# Altium project GeneralPurposePowerSupply.PrjPcb
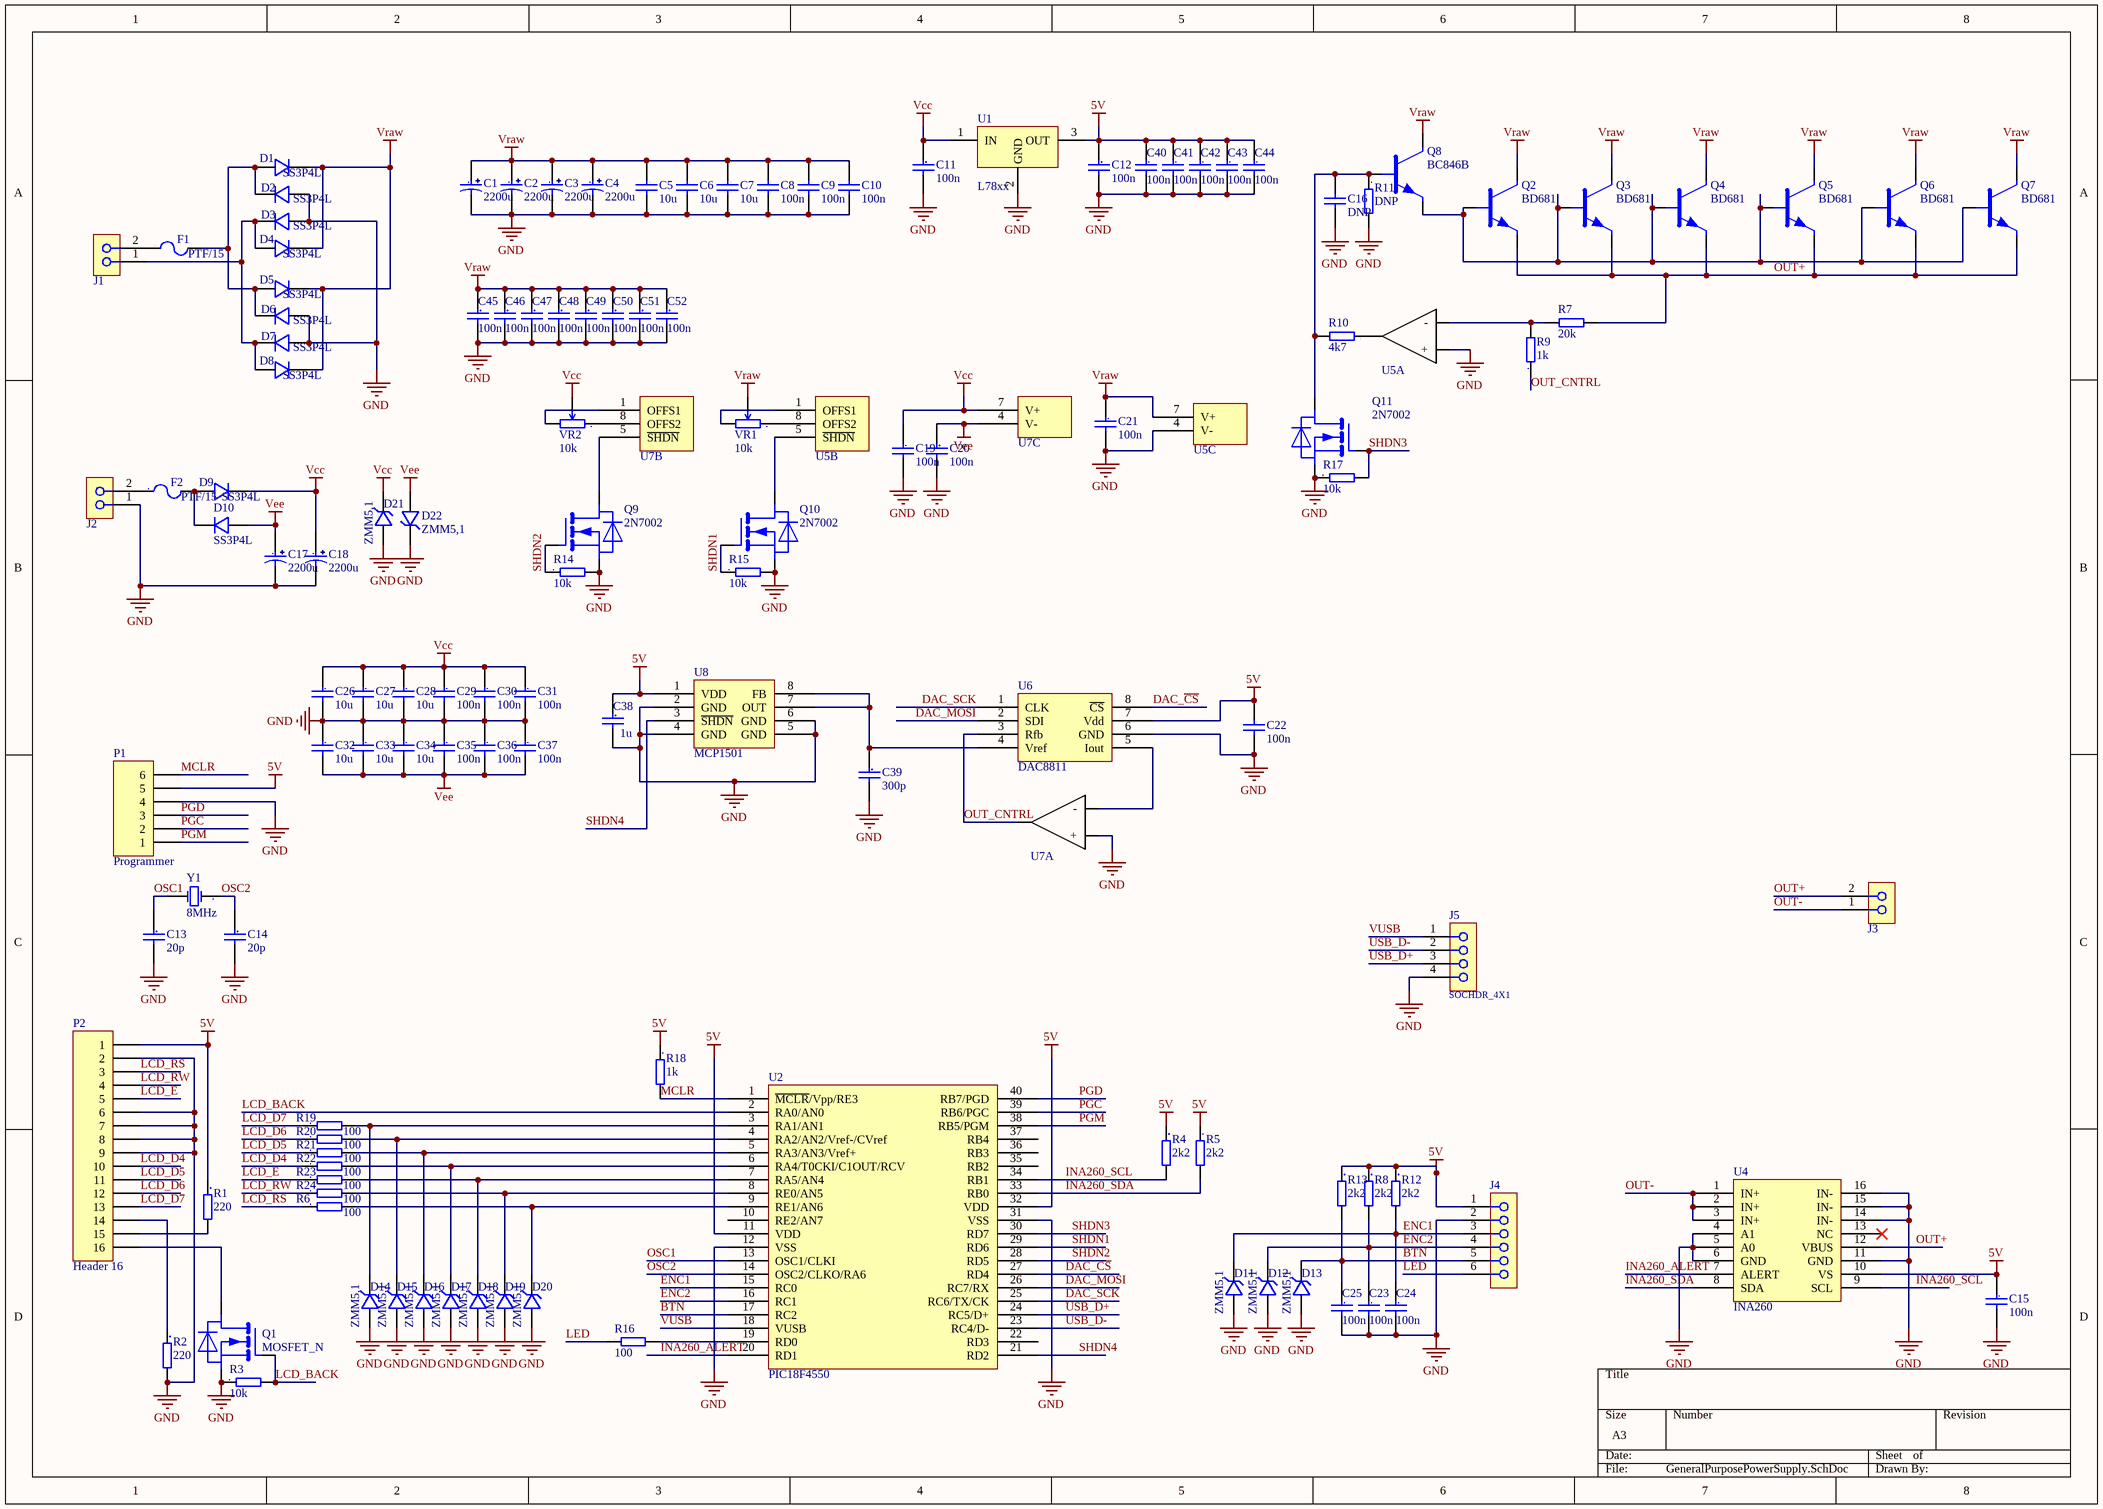
[diagram p0: GeneralPurposePowerSupply.SchDoc]
1 sheet, 128 parts. Net scope: global (net labels, ports and power ports of the same name join across sheets).
Board file: GeneralPurposePowerSupply.PcbDoc

## Sheet GeneralPurposePowerSupply.SchDoc
size A3

### Parts
C1  2200u  [C_16x32]
C2  2200u  [C_16x32]
C3  2200u  [C_16x32]
C4  2200u  [C_16x32]
C5  10u  [C0805_N]
C6  10u  [C0805_N]
C7  10u  [C0805_N]
C8  100n  [C0603_N]
C9  100n  [C0603_N]
C10  100n  [C0603_N]
C11  100n  [C0603_N]
C12  100n  [C0603_N]
C13  20p  [C0603_N]
C14  20p  [C0603_N]
C15  100n  [C0603_N]
C16  DNP  [C0603_N]
C17  2200u  [C_16x32]
C18  2200u  [C_16x32]
C19  100n  [C0603_N]
C20  100n  [C0603_N]
C21  100n  [C0603_N]
C22  100n  [C0603_N]
C23  100n  [C0603_N]
C24  100n  [C0603_N]
C25  100n  [C0603_N]
C26  10u  [C0805_N]
C27  10u  [C0805_N]
C28  10u  [C0805_N]
C29  100n  [C0603_N]
C30  100n  [C0603_N]
C31  100n  [C0603_N]
C32  10u  [C0805_N]
C33  10u  [C0805_N]
C34  10u  [C0805_N]
C35  100n  [C0603_N]
C36  100n  [C0603_N]
C37  100n  [C0603_N]
C38  1u  [C0603_N]
C39  300p  [C0603_N]
C40  100n  [C0603_N]
C41  100n  [C0603_N]
C42  100n  [C0603_N]
C43  100n  [C0603_N]
C44  100n  [C0603_N]
C45  100n  [C0603_N]
C46  100n  [C0603_N]
C47  100n  [C0603_N]
C48  100n  [C0603_N]
C49  100n  [C0603_N]
C50  100n  [C0603_N]
C51  100n  [C0603_N]
C52  100n  [C0603_N]
D1  SS3P4L  [TO-277]
D2  SS3P4L  [TO-277]
D3  SS3P4L  [TO-277]
D4  SS3P4L  [TO-277]
D5  SS3P4L  [TO-277]
D6  SS3P4L  [TO-277]
D7  SS3P4L  [TO-277]
D8  SS3P4L  [TO-277]
D9  SS3P4L  [TO-277]
D10  SS3P4L  [TO-277]
D11  ZMM5,1  [SOD-80]
D12  ZMM5,1  [SOD-80]
D13  ZMM5,1  [SOD-80]
D14  ZMM5,1  [SOD-80]
D15  ZMM5,1  [SOD-80]
D16  ZMM5,1  [SOD-80]
D17  ZMM5,1  [SOD-80]
D18  ZMM5,1  [SOD-80]
D19  ZMM5,1  [SOD-80]
D20  ZMM5,1  [SOD-80]
D21  ZMM5,1  [SOD-80]
D22  ZMM5,1  [SOD-80]
F1  PTF/15  [FUSE_PTF/15]
F2  PTF/15  [FUSE_PTF/15]
J1  (no value)  [TERM_BLOCK_2x1]
J2  (no value)  [TERM_BLOCK_2x1]
J3  (no value)  [TERM_BLOCK_2x1]
J4  (no value)  [PINSOCK_6x1_THT]
J5  SOCHDR_4X1  [PINSOCK_4x1_THT]
P1  Programmer  [HDR1X6]
P2  Header 16  [HDR1X16]
Q1  MOSFET_N  [SOT23_123_N]
Q2  BD681  [TO-126]
Q3  BD681  [TO-126]
Q4  BD681  [TO-126]
Q5  BD681  [TO-126]
Q6  BD681  [TO-126]
Q7  BD681  [TO-126]
Q8  BC846B  [SOT23_123_N]
Q9  2N7002  [SOT23_123_N]
Q10  2N7002  [SOT23_123_N]
Q11  2N7002  [SOT23_123_N]
R1  220  [R0603_N]
R2  220  [R0603_N]
R3  10k  [R0603_N]
R4  2k2  [R0603_N]
R5  2k2  [R0603_N]
R6  100  [R0603_N]
R7  20k  [R0603_N]
R8  2k2  [R0603_N]
R9  1k  [R0603_N]
R10  4k7  [R0603_N]
R11  DNP  [R0603_N]
R12  2k2  [R0603_N]
R13  2k2  [R0603_N]
R14  10k  [R0603_N]
R15  10k  [R0603_N]
R16  100  [R0603_N]
R17  10k  [R0603_N]
R18  1k  [R0603_N]
R19  100  [R0603_N]
R20  100  [R0603_N]
R21  100  [R0603_N]
R22  100  [R0603_N]
R23  100  [R0603_N]
R24  100  [R0603_N]
U1  L78xx  [TO-220]
U2  PIC18F4550  [DIP-40]
U4  INA260  [TSSOP-16]
U5  LT1218  [SOIC-8]  (value not drawn)  (parts A,B,C of 3)
U6  DAC8811  [VSSOP-8]
U7  LT1218  [SOIC-8]  (value not drawn)  (parts A,B,C of 3)
U8  MCP1501  [SOIC-8]
VR1  10k  [POT_3364W]
VR2  10k  [POT_3364W]
Y1  8MHz  [CRYSTAL_HC49/SMD]

### Nets
5V: C12.1 C15.1 C22.1 C38.1 C40.1 C41.1 C42.1 C43.1 C44.1 J4.1 P1.5 P2.1 R1.1 R4.1 R5.1 R8.1 R12.1 R13.1 R18.1 U1.3(OUT) U2.11(VDD) U2.32(VDD) U4.10(VS) U6.7(Vdd) U8.1(VDD)
GND: C1.N C2.N C3.N C4.N C5.2 C6.2 C7.2 C8.2 C9.2 C10.2 C11.2 C12.2 C13.2 C14.2 C15.2 C16.2 C17.N C18.N C19.2 C20.2 C21.2 C22.2 C23.2 C24.2 C25.2 C26.2 C27.2 C28.2 C29.2 C30.2 C31.2 C32.1 C33.1 C34.1 C35.1 C36.1 C37.1 C38.2 C39.2 C40.2 C41.2 C42.2 C43.2 C44.2 C45.2 C46.2 C47.2 C48.2 C49.2 C50.2 C51.2 C52.2 D2.A D3.A D6.A D7.A D11.A D12.A D13.A D14.A D15.A D16.A D17.A D18.A D19.A D20.A D21.A D22.C J2.1 J4.2 J5.4 P1.4 P2.2 P2.6 P2.7 P2.8 P2.9 Q1.S Q9.S Q10.S Q11.S R2.2 R3.1 R11.2 R14.2 R15.2 R17.1 U1.2(GND) U2.12(VSS) U2.31(VSS) U4.4(A1) U4.5(A0) U4.6(GND) U4.11(GND) U4.14(IN-) U4.15(IN-) U4.16(IN-) U5.3(+) U5.4(V-) U6.6(GND) U7.3(+) U8.2(GND) U8.4(GND) U8.5(GND) U8.6(GND)
Vcc: C11.1 C18.P C19.1 C26.1 C27.1 C28.1 C29.1 C30.1 C31.1 D9.C D21.C U1.1(IN) U7.7(V+) VR2.WIPER
Vee: C17.P C20.1 C32.2 C33.2 C34.2 C35.2 C36.2 C37.2 D10.A D22.A U7.4(V-)
Vraw: C1.P C2.P C3.P C4.P C5.1 C6.1 C7.1 C8.1 C9.1 C10.1 C21.1 C45.1 C46.1 C47.1 C48.1 C49.1 C50.1 C51.1 C52.1 D1.C D4.C D5.C D8.C Q2.C Q3.C Q4.C Q5.C Q6.C Q7.C Q8.C U5.7(V+) VR1.WIPER
BTN: C25.1 D13.C J4.5 R13.2 U2.17(RC2)
DAC_~{CS}: U2.27(RD4) U6.8(~{CS})
DAC_MOSI: U2.26(RC7/RX) U6.2(SDI)
DAC_SCK: U2.25(RC6/TX/CK) U6.1(CLK)
ENC1: C24.1 D11.C J4.3 R12.2 U2.15(RC0)
ENC2: C23.1 D12.C J4.4 R8.2 U2.16(RC1)
INA260_ALERT: U2.20(RD1) U4.7(ALERT)
INA260_SCL: R4.2 U2.34(RB1) U4.9(SCL)
INA260_SDA: R5.2 U2.33(RB0) U4.8(SDA)
LCD_BACK: Q1.G R3.2 U2.2(RA0/AN0)
LCD_D4: P2.10 R22.1
LCD_D5: P2.11 R21.1
LCD_D6: P2.12 R20.1
LCD_D7: P2.13 R19.1
LCD_E: P2.5 R23.1
LCD_RS: P2.3 R6.1
LCD_RW: P2.4 R24.1
LED: J4.6 R16.1
MCLR: P1.6 R18.2 U2.1(~{MCLR}/Vpp/RE3)
OSC1: C13.1 U2.13(OSC1/CLKI) Y1.2(OSC2)
OSC2: C14.1 U2.14(OSC2/CLKO/RA6) Y1.1
OUT+: J3.2 Q2.E Q3.E Q4.E Q5.E Q6.E Q7.E R7.1 U4.12(VBUS)
OUT-: J3.1 U4.1(IN+) U4.2(IN+) U4.3(IN+)
OUT_CNTRL: R9.1 U6.3(Rfb) U7.6(Out)
PGC: P1.2 U2.39(RB6/PGC)
PGD: P1.3 U2.40(RB7/PGD)
PGM: P1.1 U2.38(RB5/PGM)
SHDN1: Q10.G R15.1 U2.29(RD6)
SHDN2: Q9.G R14.1 U2.28(RD5)
SHDN3: Q11.G R17.2 U2.30(RD7)
SHDN4: U2.21(RD2) U8.3(~{SHDN})
USB_D+: J5.3 U2.24(RC5/D+)
USB_D-: J5.2 U2.23(RC4/D-)
VUSB: J5.1 U2.18(VUSB)
NetC16_1: C16.1 Q8.B Q11.D R10.2 R11.1
NetC39_1: C39.1 U6.4(Vref) U8.7(OUT) U8.8(FB)
NetD1_A: D1.A D2.C D5.A D6.C F1.2
NetD3_C: D3.C D4.A D7.C D8.A J1.1
NetD9_A: D9.A D10.C F2.2
NetD14_C: D14.C R19.2 U2.3(RA1/AN1)
NetD15_C: D15.C R20.2 U2.4(RA2/AN2/Vref-/CVref)
NetD16_C: D16.C R21.2 U2.5(RA3/AN3/Vref+)
NetD17_C: D17.C R22.2 U2.6(RA4/T0CKI/C1OUT/RCV)
NetD18_C: D18.C R23.2 U2.7(RA5/AN4)
NetD19_C: D19.C R24.2 U2.8(RE0/AN5)
NetD20_C: D20.C R6.2 U2.9(RE1/AN6)
NetF1_1: F1.1 J1.2
NetF2_1: F2.1 J2.2
NetP2_14: P2.14 R2.1
NetP2_15: P2.15 R1.2
NetP2_16: P2.16 Q1.D
NetQ2_B: Q2.B Q3.B Q4.B Q5.B Q6.B Q7.B Q8.E
NetQ9_D: Q9.D U7.5(~{SHDN})
NetQ10_D: Q10.D U5.5(~{SHDN})
NetR7_2: R7.2 R9.2 U5.2(-)
NetR10_1: R10.1 U5.6(Out)
NetR16_2: R16.2 U2.19(RD0)
NetU5_1: U5.1(OFFS1) VR1.CW
NetU5_8: U5.8(OFFS2) VR1.CCW
NetU6_5: U6.5(Iout) U7.2(-)
NetU7_1: U7.1(OFFS1) VR2.CW
NetU7_8: U7.8(OFFS2) VR2.CCW

Not connected (* = marked no-connect by the designer): U2 10(RE2/AN7) 22(RD3) 35(RB2) 36(RB3) 37(RB4); U4 13(NC)*

### Library data of the parts
C1-C4 C17 C18 = CAP_POL: RevS: $Rev:: 58        $
C5-C16 C19-C52 = CAP: RevS: $Rev:: 58        $
D1-D10 = DIODE
D11-D22 = DIODE_ZENER
F1 F2 = FUSE
J1-J3 = SOCHDR_2X1: Socket; ComponentLink1Description: Manufacturer; ComponentLink1URL: http://www.we-online.de; ComponentLink2Description: Datasheet; ComponentLink2URL: http://katalog.we-online.de/em/datasheet/691412320002.pdf
J4 = SOCHDR_6X1: Socket; ComponentLink1Description: Manufacturer; ComponentLink1URL: http://www.we-online.de; ComponentLink2Description: Datasheet; ComponentLink2URL: http://katalog.we-online.de/em/datasheet/691412320002.pdf
J5 = SOCHDR_4X1: Socket; ComponentLink1Description: Manufacturer; ComponentLink1URL: http://www.we-online.de; ComponentLink2Description: Datasheet; ComponentLink2URL: http://katalog.we-online.de/em/datasheet/691412320002.pdf
P1 = Header 6: Header, 6-Pin; LatestRevisionDate: 17-Jul-2002; LatestRevisionNote: Re-released for DXP Platform.; Publisher: Altium Limited
P2 = Header 16: Header, 16-Pin; LatestRevisionDate: 17-Jul-2002; LatestRevisionNote: Re-released for DXP Platform.; Publisher: Altium Limited
Q1 Q9-Q11 = MOSFET_N: pin to pad: D>3 G>1 S>2
Q2-Q7 = BJT_NPN
Q8 = BJT_NPN: pin to pad: B>1 C>3 E>2
R1-R24 = RES
U2 = PIC18F4550_DIP40: PIC18F4550 40 pin type
U6 = DAC8811: 16 bit, 3-wire SPI DAC
U8 = MCP1501: SOIC-8 Volatage reference
VR1 VR2 = RES_POT_M: Mono; pin to pad: CCW>1 CW>3 WIPER>2
Y1 = XTAL_12